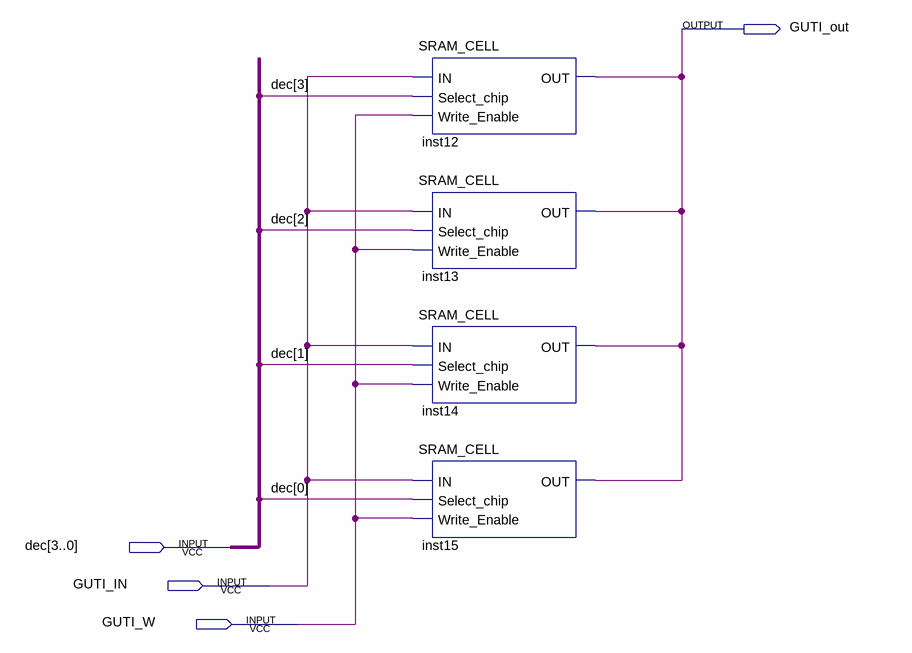
[diagram p0: schematic sheet]
// Quartus schematic SRAM_4.bdf as structural Verilog: 4 symbols, 4 pins
module SRAM_4 (
  input  [3:0] dec,
  input  GUTI_IN,
  input  GUTI_W,
  output GUTI_out
);

  SRAM_CELL inst12 (.IN(GUTI_IN), .Select_chip(dec[3]), .Write_Enable(GUTI_W), .OUT(GUTI_out));
  SRAM_CELL inst13 (.IN(GUTI_IN), .Select_chip(dec[2]), .Write_Enable(GUTI_W), .OUT(GUTI_out));
  SRAM_CELL inst14 (.IN(GUTI_IN), .Select_chip(dec[1]), .Write_Enable(GUTI_W), .OUT(GUTI_out));
  SRAM_CELL inst15 (.IN(GUTI_IN), .Select_chip(dec[0]), .Write_Enable(GUTI_W), .OUT(GUTI_out));
endmodule
